# EAGLE design HEG_50mm_SENSOR (EAGLE 9.5.1)
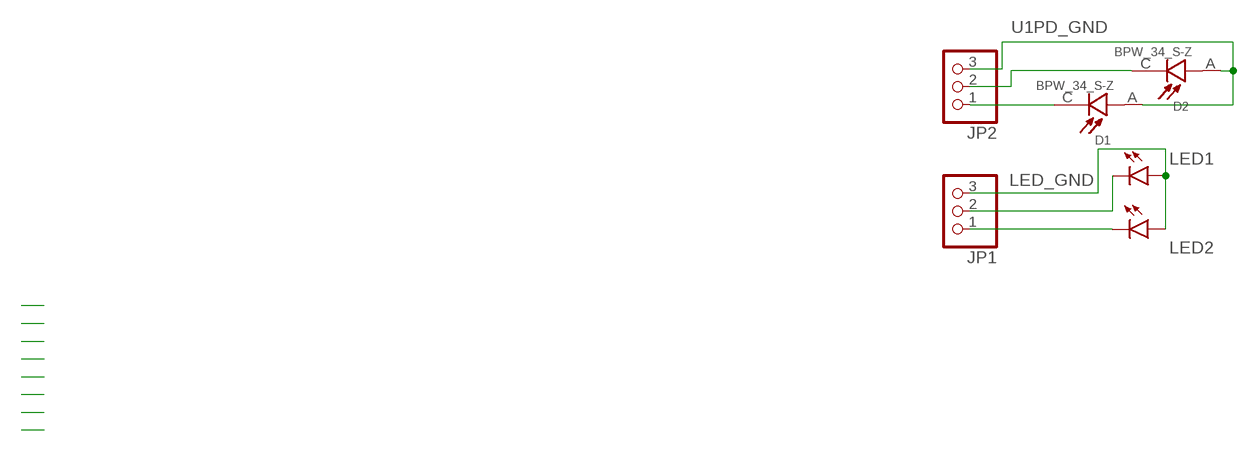
[diagram p0: schematic, sheet 1]

## Parts
D1  BPW_34_S-Z  [DIO_BPW_34_S-Z]
D2  BPW_34_S-Z  [DIO_BPW_34_S-Z]
JP1  PINHD-1X3  [1X03]
JP2  PINHD-1X3  [1X03]
LED1  LEDCHIPLED_1206  [CHIPLED_1206]
LED2  LEDCHIPLED_1206  [CHIPLED_1206]

## Nets
LED_GND: JP1.3 LED1.A LED2.A
N$10: JP1.1 LED2.C
N$11: JP1.2 LED1.C
N$12: D1.C JP2.1
N$13: D2.C JP2.2
U1PD_GND: D1.A D2.A JP2.3

## Library data of the parts
D1 D2 = BPW_34_S-Z:BPW_34_S-Z: Silicon PIN Photodiode; DESCRIPTION: Photodiode 850nm 20ns 120° 2-SMD, Gull Wing; DIGI-KEY_PART_NUMBER: 475-2659-1-ND; DIGI-KEY_PURCHASE_URL: https://www.digikey.com/product-detail/en/osram-opto-semiconductors-inc/BPW-34-S-Z/475-2659-1-ND/1893861?utm_source=snapeda&utm_medium=aggregator&utm_campaign=symbol; MF: OSRAM Opto; MP: BPW 34 S-Z; PACKAGE: SMD-2 OSRAM Opto
JP1 JP2 = adafruit:PINHD-1X3: PIN HEADER
LED1 LED2 = led:LED: LED OSRAM: - CHIPLED LG R971, LG N971, LY N971, LG Q971, LY Q971, LO R971, LY R971 LH N974, LH R974 LS Q976, LO Q976, LY Q976 LO Q996 - Hyper CHIPLED LW Q18S LB Q993, LB Q99A, LB R99A - SideLED LS A670, LO A670, LY A670, LG A670, LP A670 LB A673, LV A673, LT A673, LW A673 LH A674 LY A675 LS A676, LA A676, LO A676, LY A676, LW A676 LS A679, LY A679, LG A679 - Hyper Micro SIDELED® LS Y876, LA Y876, LO Y876, LY Y876 LT Y87S - SmartLED LW L88C, LW L88S LB L89C, LB L89S, LG L890 LS L89K, LO L89K, LY L89K LS L896, LA L896, LO L896, LY L896 - TOPLED LS T670, LO T670, LY T670, LG T670, LP T670 LSG T670, LSP T670, LSY T670, LOP T670, LYG T670 LG T671, LOG T671, LSG T671 LB T673, LV T673, LT T673, LW T673 LH T674 LS T676, LA T676, LO T676, LY T676, LB T676, LH T676, LSB T676, LW T676 LB T67C, LV T67C, LT T67C, LS T67K, LO T67K, LY T67K, LW E67C LS E67B, LA E67B, LO E67B, LY E67B, LB E67C, LV E67C, LT E67C LW T67C LS T679, LY T679, LG T679 LS T770, LO T770, LY T770, LG T770, LP T770 LB T773, LV T773, LT T773, LW T773 LH T774 LS E675, LA E675, LY E675, LS T675 LS T776, LA T776, LO T776, LY T776, LB T776 LHGB T686 LT T68C, LB T68C - Hyper Mini TOPLED® LB M676 - Mini TOPLED Santana® LG M470 LS M47K, LO M47K, LY M47K Source: http://www.osram.convergy.de LUXEON: - LUMILED® LXK2-PW12-R00, LXK2-PW12-S00, LXK2-PW14-U00, LXK2-PW14-V00 LXK2-PM12-R00, LXK2-PM12-S00, LXK2-PM14-U00 LXK2-PE12-Q00, LXK2-PE12-R00, LXK2-PE12-S00, LXK2-PE14-T00, LXK2-PE14-U00 LXK2-PB12-K00, LXK2-PB12-L00, LXK2-PB12-M00, LXK2-PB14-N00, LXK2-PB14-P00, LXK2-PB14-Q00 LXK2-PR12-L00, LXK2-PR12-M00, LXK2-PR14-Q00, LXK2-PR14-R00 LXK2-PD12-Q00, LXK2-PD12-R00, LXK2-PD12-S00 LXK2-PH12-R00, LXK2-PH12-S00 LXK2-PL12-P00, LXK2-PL12-Q00, LXK2-PL12-R00 Source: www.luxeon.com KINGBRIGHT: KA-3528ASYC Source: www.kingbright.com

## Board
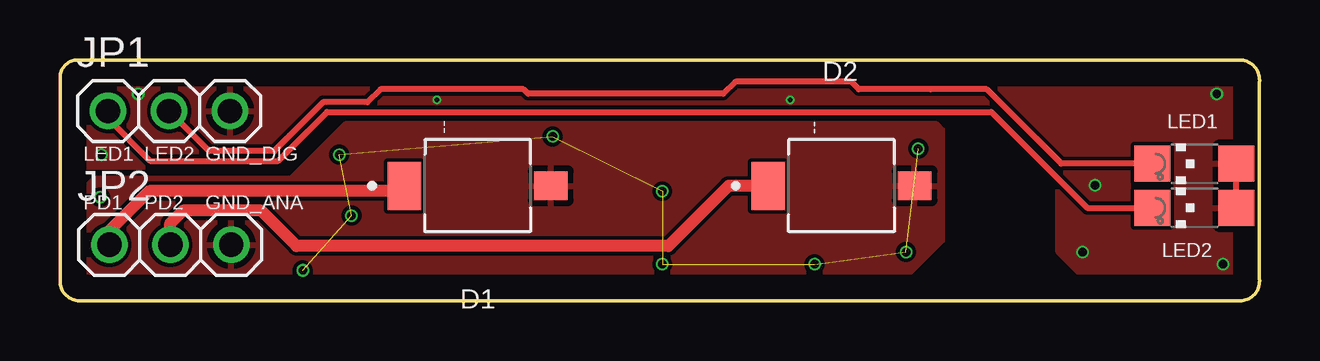
[diagram p1: board, top side]
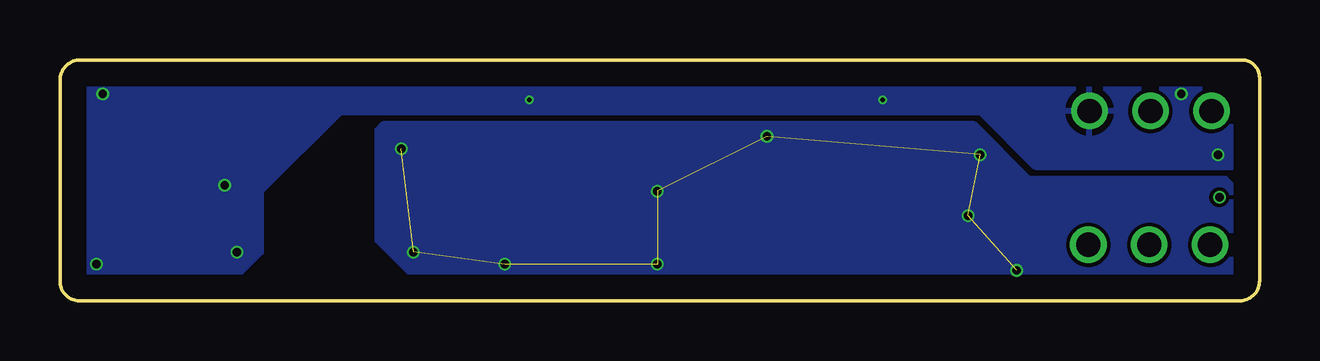
[diagram p2: board, bottom side, seen from below]

Size 50 x 10.05 mm. Coordinates in mm from the lower left corner, seen from the top.
Outline: 49.26,0 arc90 50,0.91 50,9.11 arc90 49.24,10.05 0.74,10.05 arc90 0,9.31 0,0.84 arc90 0.81,0 49.26,0
Copper layers (1*16): Top 0.035mm / dielectric 1.5mm / Bottom 0.035mm
Design rules "default *": minimum track width 6mil, minimum drill 0.35mm, track to track 6mil, track to pad 6mil, pad to pad 6mil, via to via 2mil, smd to smd 6mil, copper to edge 40mil, drill to drill 6mil, minimum pad ring 10mil, minimum via ring 3mil, stop-mask expansion 4mil, vias tented up to drill 0mil, thermal gap 10mil

### Footprints (pad centres in the part's own frame; a part is rotated, then mirrored left to right if it is on the bottom)
DIO_BPW_34_S-Z = smd 1.4 x 1.2: A -3.05,0 | smd 1.4 x 2: C 3.05,0
1X03 = drill 1.016: 1 -2.54,0; 2 0,0; 3 2.54,0
CHIPLED_1206 = smd 1.5 x 1.5: A 0,-1.75; C 0,1.75

### Placement (x,y rotation side)
D1  17.41,4.8 180 top
D2  32.57,4.8 180 top
JP1  4.55,7.92 0 top
JP2  4.6,2.34 0 top
LED1  47.29,5.72 90 top
LED2  47.29,3.88 90 top

### Tracks (layer width: path | path; a pad name or v marks a point on that pad's centre or on a via)
LED_GND  (via drill 0.2, 0.35)
  Top 0.254: LED2.A LED1.A
  other vias: 48.22,8.64 48.47,1.52 42.63,2.03 1.74,6.1 3.26,8.64 15.71,8.38 30.44,8.38 43.14,4.83
  pour Top: 0.98,5.59 0.21,6.35 0.21,9.14 0.98,9.91 49.49,9.91 50,9.4 50,5.33 50,0.76 49.24,0 43.65,0 43.39,0.25 41.62,2.03 41.62,4.57 38.31,7.87 36.79,7.87 11.64,7.87 9.36,5.59
  pour Bottom: 0.21,7.62 0.21,9.14 0.98,9.91 48.98,9.91 49.49,9.91 50,9.4 50,0.76 49.24,0 43.65,0 41.62,2.03 41.62,4.57 38.31,7.87 11.64,7.87 9.36,5.59 0.98,5.59 0.21,6.35
N$1  (via drill 0.35)
  other vias: 1.68,4.32
N$10
  Top 0.254: JP1.1 2.01,7.61 3.77,5.84 9.1,5.84 11.14,7.87 38.82,7.87 42.81,3.88 LED2.C
N$11
  Top 0.254: LED1.C 41.74,5.72 38.63,8.83 36.28,8.83 33.29,8.83 32.98,9.14 28.15,9.14 27.65,8.64 19.52,8.64 19.32,8.83 13.36,8.83 12.81,8.28 10.97,8.28 8.94,6.25 6.22,6.25 JP1.2
N$12
  Top 0.508: D1.C 14.13,4.58 3.71,4.58 2.06,2.92 JP2.1
N$13
  Top 0.508: D2.C 27.87,4.8 25.36,2.29 9.86,2.29 8.38,3.76 5.13,3.76 4.6,3.23 JP2.2
U1_PDGND  (via drill 0.35)  (8 unrouted)
  other vias: 35.77,6.35 35.27,2.03 31.46,1.52 12.15,3.56 20.53,6.86 25.11,4.57 11.64,6.1 10.12,1.27 25.11,1.52
  pour Bottom: 0.41,1.27 0.41,4.07 1.42,5.08 9.61,5.08 11.9,7.37 36.54,7.37 36.79,7.11 36.79,2.54 34.76,0.51 1.17,0.51
U1PD_GND
  pour Top: 36.79,2.54 36.79,7.11 36.54,7.37 11.9,7.37 9.61,5.08 1.42,5.08 0.41,4.07 0.41,1.27 1.17,0.51 34.76,0.51

### Text on the board
tPlace: -- | --
tValuesAlt: LED1 | P2 | P1 | cathode | LED2 | C4
_tNames: LED1 | LED2 | GND_DIG | PD1 | PD2 | GND_ANA